# EAGLE design Breadboard Amp (EAGLE 8.0.2)
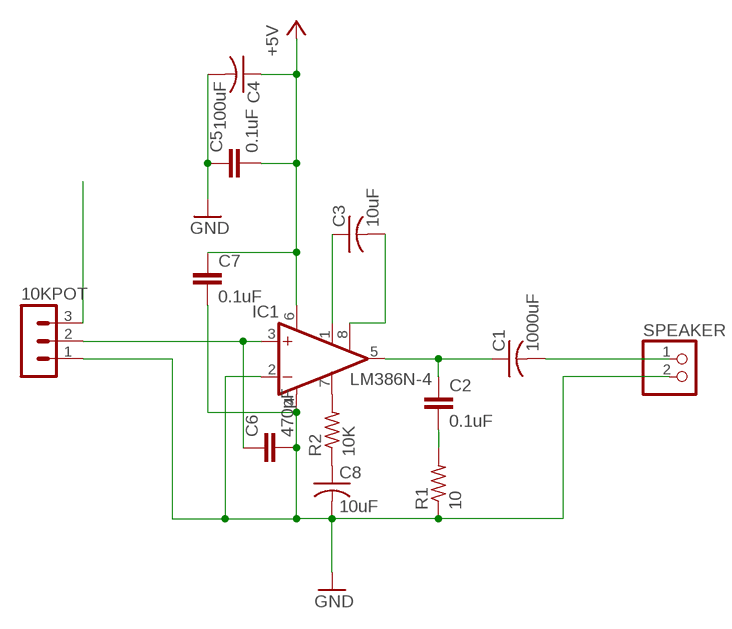
[diagram p0: schematic, sheet 1]

## Parts
10KPOT  MA03-1  [MA03-1]
C1  1000uF  C-US025-030X050  [C025-030X050]
C2  0.1uF  C2.5/4  [C2.5-4]
C3  10uF  C-US025-030X050  [C025-030X050]
C4  100uF  C-US025-030X050  [C025-030X050]
C5  0.1uF  C2.5/4  [C2.5-4]
C6  470pF  C2.5/4  [C2.5-4]
C7  0.1uF  C2.5/4  [C2.5-4]
C8  10uF  C-US025-030X050  [C025-030X050]
IC1  LM386N-4  [DIL08]
R1  10  R-US_0207/7  [0207/7]
R2  10K  R-US_0207/7  [0207/7]
SPEAKER  PINHD-1X2  [1X02]

## Nets
+5V: C4.1 C5.2 C7.1 IC1.6(VS)
GND: 10KPOT.1 C4.2 C5.1 C6.2 C7.2 C8.2 IC1.2(-IN) IC1.4(GND) R1.1 SPEAKER.2
N$1: C3.1 IC1.1(GAIN)
N$2: C3.2 IC1.8(GAIN)
N$3: C1.1 C2.1 IC1.5(OUT)
N$4: IC1.7(BYPASS) R2.2
N$5: C8.1 R2.1
N$6: 10KPOT.2 C6.1 IC1.3(+IN)
N$7: C2.2 R1.2
N$8: 10KPOT.3
N$9: C1.2 SPEAKER.1

## Library data of the parts
10KPOT = con-lstb:MA03-1: PIN HEADER; OC_FARNELL: unknown; OC_NEWARK: unknown
C1 C3 C4 C8 = rcl:C-US: CAPACITOR, American symbol
C2 C5-C7 = capacitor-wima:C: CAPACITOR naming: grid - package width
IC1 = linear:LM386?-*: Low Voltage Audio Power Amplifier Source: http://cache.national.com/ds/LM/LM386.pdf
R1 R2 = resistor:R-US_: RESISTOR, American symbol
SPEAKER = pinhead:PINHD-1X2: PIN HEADER

## Board
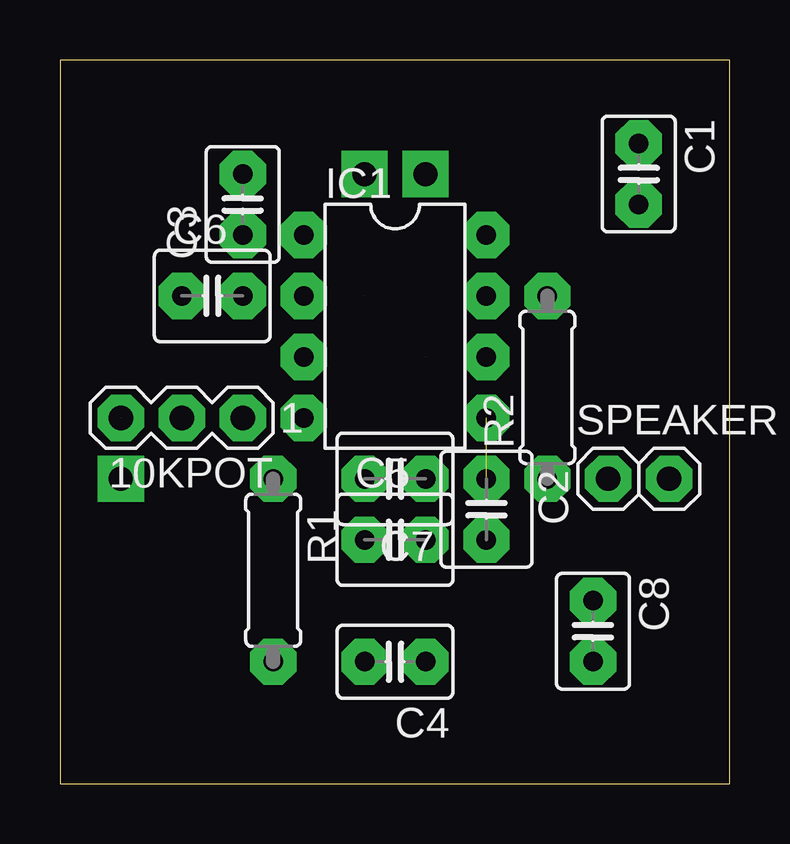
[diagram p1: board, top side]
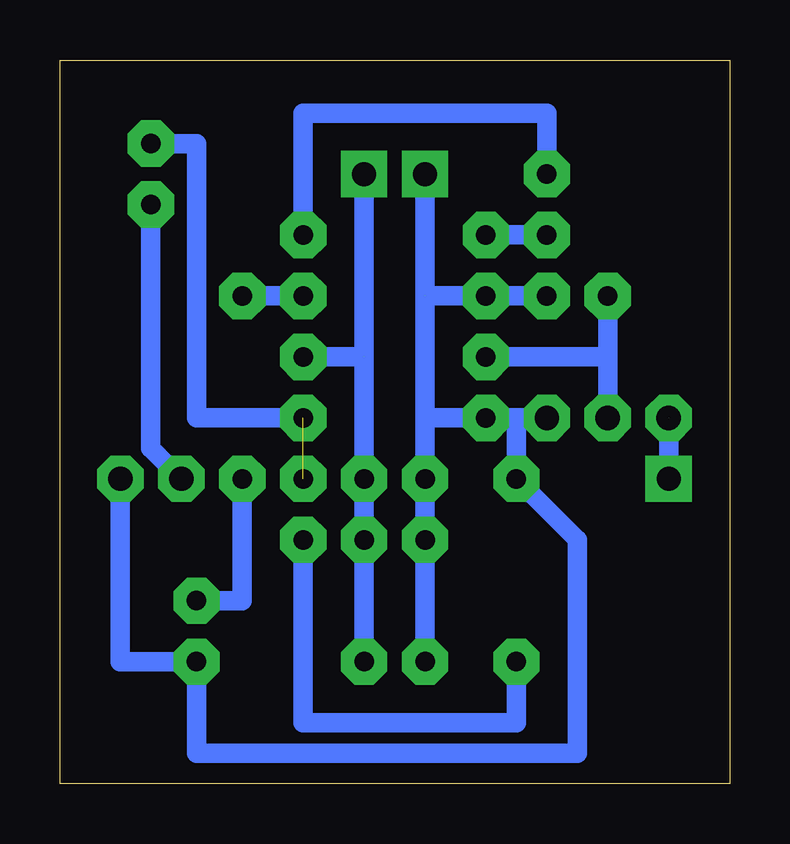
[diagram p2: board, bottom side, seen from below]

Size 27.92 x 30.15 mm. Coordinates in mm from the lower left corner, seen from the top.
Outline: 0,0 27.92,0 27.92,30.15 0,30.15 0,0
Copper layers (1*16): Top 0.035mm / dielectric 1.5mm / Bottom 0.035mm
Design rules "default": minimum track width 10mil, minimum drill 24mil, track to track 8mil, track to pad 8mil, pad to pad 8mil, via to via 8mil, smd to smd 8mil, copper to edge 40mil, drill to drill 8mil, minimum pad ring 10mil, minimum via ring 8mil, stop-mask expansion 4mil, vias tented up to drill 0mil, thermal gap 10mil

### Footprints (pad centres in the part's own frame; a part is rotated, then mirrored left to right if it is on the bottom)
MA03-1 = drill 1.016 pad 1.93 octagon: 1 -2.54,0; 2 0,0; 3 2.54,0
C025-030X050 = drill 0.813 pad 1.93 octagon: 1 -1.27,0; 2 1.27,0
C2.5-4 = drill 0.813 pad 1.93 octagon: 1 -1.27,0; 2 1.27,0
DIL08 = drill 0.813 pad 1.93 octagon: 1 -3.81,-3.81; 2 -1.27,-3.81; 3 1.27,-3.81; 4 3.81,-3.81; 5 3.81,3.81; 6 1.27,3.81; 7 -1.27,3.81; 8 -3.81,3.81
0207/7 = drill 0.813 pad 1.93 octagon: 1 -3.81,0; 2 3.81,0
1X02 = drill 1.016 pad 1.93 octagon: 1 -1.27,0; 2 1.27,0

### Placement (x,y rotation side)
10KPOT  5.08,15.24 180 top
C1  24.13,25.4 270 top
C2  17.78,11.43 270 top
C3  7.62,24.13 90 top
C4  13.97,5.08 180 top
C5  13.97,10.16 0 top
C6  6.35,20.32 0 top
C7  13.97,12.7 180 top
C8  22.23,6.35 270 top
IC1  13.97,19.05 270 top
R1  8.89,8.89 270 top
R2  20.32,16.51 90 top
SPEAKER  24.13,12.7 0 top

### Tracks (layer width: path | path; a pad name or v marks a point on that pad's centre or on a via)
+5V  (via drill 1 pad 1.93)  (1 unrouted)
  Bottom 0.813: 15.24,17.78 C7.1 C5.2 C4.1 | 15.24,17.78 IC1.6 | 15.24,17.78 v15.24,25.4
GND  (via drill 1 pad 1.93)  (1 unrouted)
  Bottom 0.813: 8.89,15.24 10KPOT.1 | 8.89,15.24 IC1.4 12.7,15.24 | 8.89,15.24 R1.1 6.35,10.16 6.35,1.27 22.23,1.27 C8.2 25.4,5.08 SPEAKER.2 | 12.7,15.24 C7.2 C5.1 C4.2 | 12.7,20.32 IC1.2 C6.2 | 12.7,20.32 12.7,15.24 | 12.7,20.32 v12.7,25.4
N$1
  Bottom 0.813: C3.1 IC1.1
N$2
  Bottom 0.813: C3.2 7.62,27.94 17.78,27.94 IC1.8
N$3  (1 unrouted)
  Bottom 0.813: C1.1 22.23,26.67 22.23,15.24 IC1.5
N$4
  Bottom 0.813: IC1.7 R2.2
N$5
  Bottom 0.813: R2.1 20.32,7.62 C8.1
N$6
  Bottom 0.813: 5.08,17.78 10KPOT.2 | 5.08,17.78 IC1.3 | C6.1 5.08,17.78
N$7
  Bottom 0.813: R1.2 8.89,2.54 17.78,2.54 C2.2
N$8  (via drill 1 pad 1.93)  (1 unrouted)
  Bottom 0.813: 10KPOT.3 v2.54,12.7
N$9
  Bottom 0.813: SPEAKER.1 24.13,13.97 C1.2